# EAGLE design 5watch (EAGLE 7.4.0)
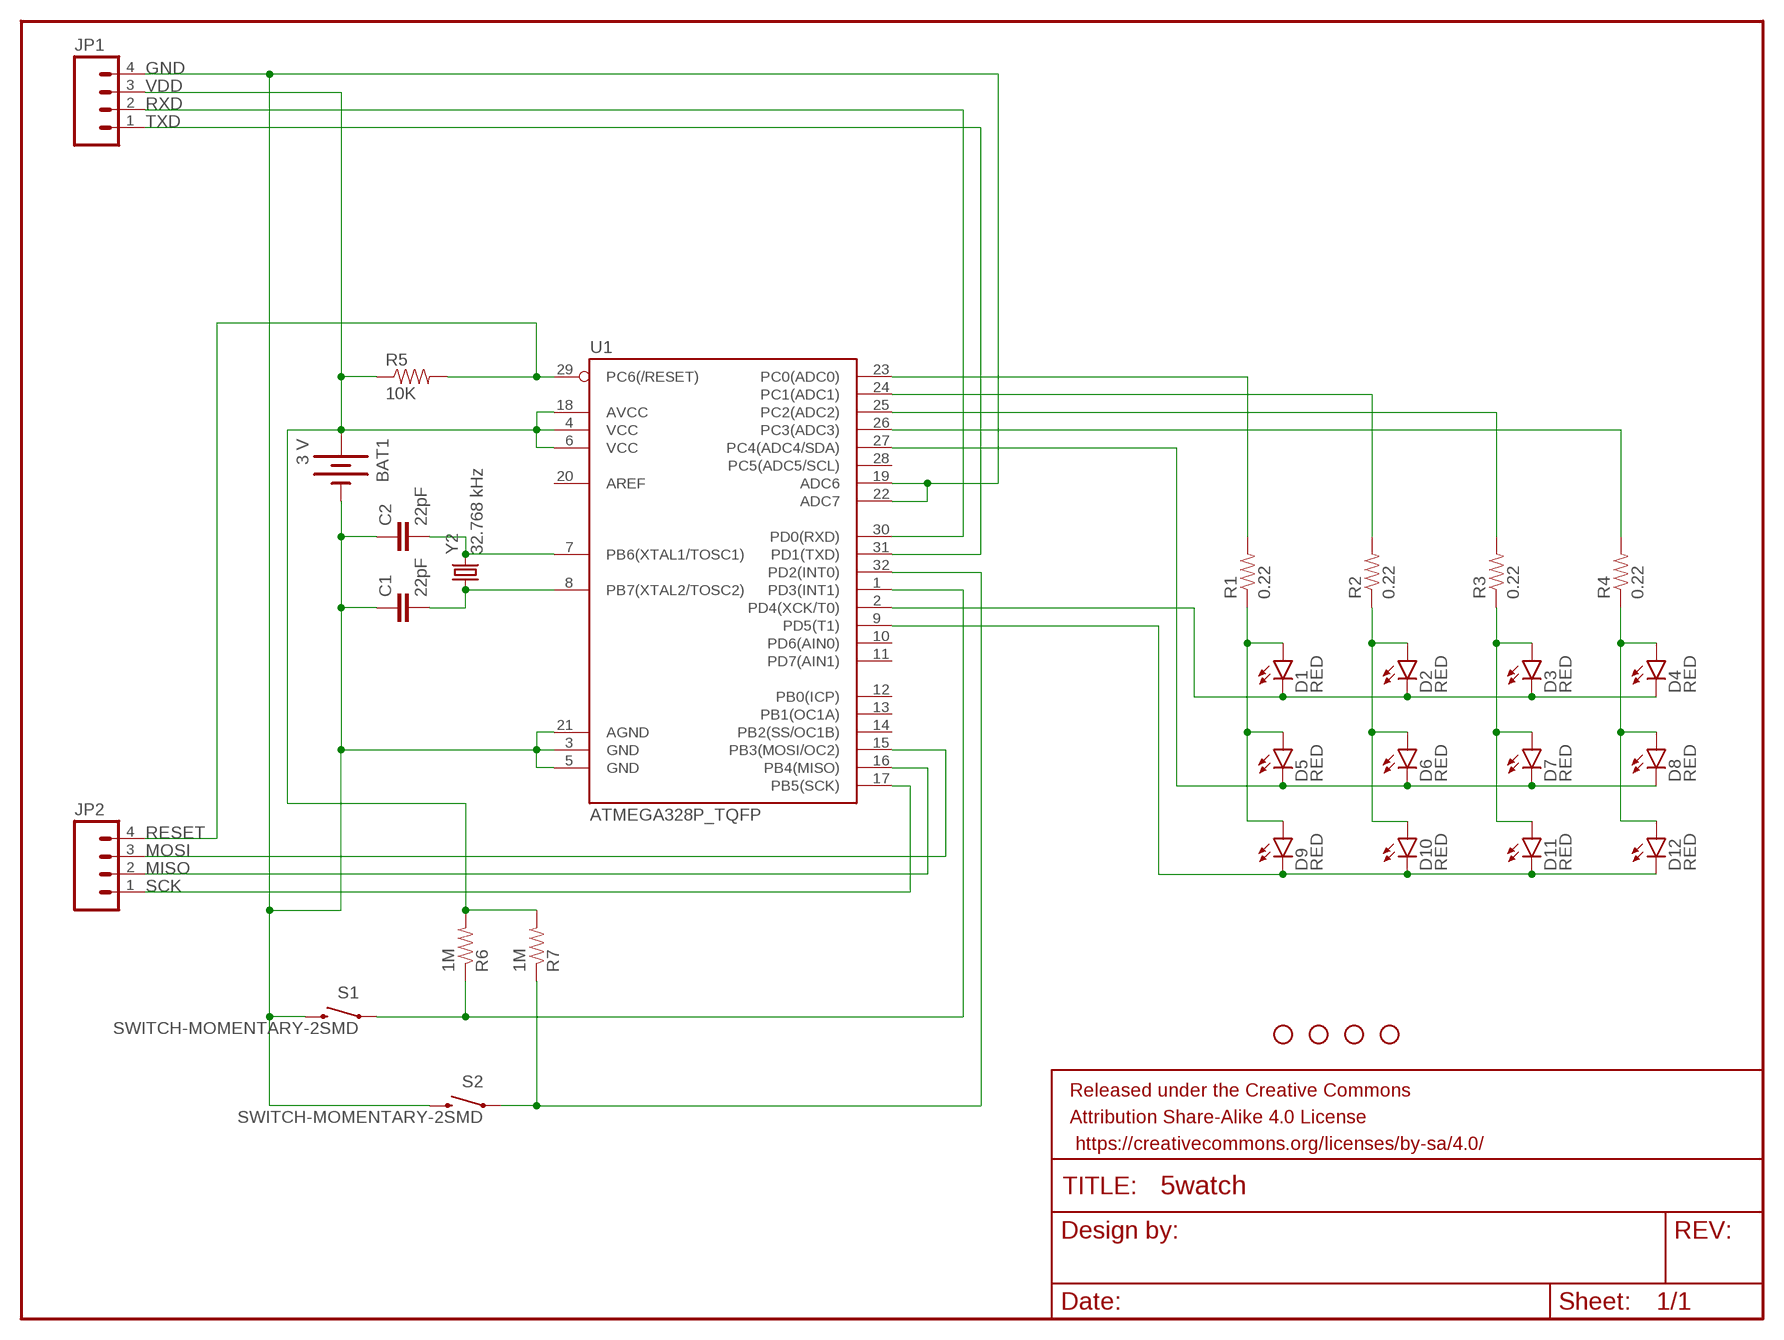
[diagram p0: schematic, sheet 1]

## Parts
BAT1  3 V  BATTERY20MM_4LEGS  [BATTCON_20MM_4LEGS]
C1  22pF  22PF-50V-5%(0603)  [0603-CAP]
C2  22pF  22PF-50V-5%(0603)  [0603-CAP]
D1  RED  LED-RED1206  [LED-1206]
D2  RED  LED-RED1206  [LED-1206]
D3  RED  LED-RED1206  [LED-1206]
D4  RED  LED-RED1206  [LED-1206]
D5  RED  LED-RED1206  [LED-1206]
D6  RED  LED-RED1206  [LED-1206]
D7  RED  LED-RED1206  [LED-1206]
D8  RED  LED-RED1206  [LED-1206]
D9  RED  LED-RED1206  [LED-1206]
D10  RED  LED-RED1206  [LED-1206]
D11  RED  LED-RED1206  [LED-1206]
D12  RED  LED-RED1206  [LED-1206]
FRAME1  FRAME-LETTER  [CREATIVE_COMMONS]
JP1  M04NO_SILK_ALL_ROUND  [1X04_NO_SILK_ALL_ROUND]
JP2  M04NO_SILK_ALL_ROUND  [1X04_NO_SILK_ALL_ROUND]
R1  0.22  0.22OHM-1/4W-1%(0805)  [0805]
R2  0.22  0.22OHM-1/4W-1%(0805)  [0805]
R3  0.22  0.22OHM-1/4W-1%(0805)  [0805]
R4  0.22  0.22OHM-1/4W-1%(0805)  [0805]
R5  10K  10KOHM-1/10W-1%(0603)0603  [0603-RES]
R6  1M  1MOHM-1/10W-1%(0603)  [0603-RES]
R7  1M  1MOHM-1/10W-1%(0603)  [0603-RES]
S1  SWITCH-MOMENTARY-2SMD  [TACTILE-SWITCH-SMD]
S2  SWITCH-MOMENTARY-2SMD  [TACTILE-SWITCH-SMD]
STANDOFF1  STAND-OFF  [STAND-OFF]
STANDOFF2  STAND-OFF  [STAND-OFF]
STANDOFF3  STAND-OFF  [STAND-OFF]
STANDOFF4  STAND-OFF  [STAND-OFF]
U1  ATMEGA328P_TQFP  [TQFP32-08]
Y2  32.768 kHz  CRYSTAL32-SMD  [CRYSTAL-32KHZ-SMD]

## Nets
GND: BAT1.2(-) C1.1 C2.1 JP1.4 S1.3 S2.3 U1.3(GND) U1.5(GND) U1.19(ADC6) U1.21(AGND) U1.22(ADC7)
MISO: JP2.2 U1.16(PB4(MISO))
MOSI: JP2.3 U1.15(PB3(MOSI/OC2))
N$1: D2.A D6.A D10.A R2.1
N$2: D3.A D7.A D11.A R3.1
N$3: D4.A D8.A D12.A R4.1
N$4: D1.A D5.A D9.A R1.1
N$5: D1.C D2.C D3.C D4.C U1.2(PD4(XCK/T0))
N$6: D5.C D6.C D7.C D8.C U1.27(PC4(ADC4/SDA))
N$7: D9.C D10.C D11.C D12.C U1.9(PD5(T1))
N$8: C2.2 U1.7(PB6(XTAL1/TOSC1)) Y2.X2
N$9: R6.1 S1.1 U1.1(PD3(INT1))
N$10: C1.2 U1.8(PB7(XTAL2/TOSC2)) Y2.X1
N$13: R4.2 U1.26(PC3(ADC3))
N$19: R3.2 U1.25(PC2(ADC2))
N$20: R2.2 U1.24(PC1(ADC1))
N$21: R1.2 U1.23(PC0(ADC0))
N$23: R7.1 S2.1 U1.32(PD2(INT0))
RESET: JP2.4 R5.2 U1.29(PC6(/RESET))
RXD: JP1.2 U1.30(PD0(RXD))
SCK: JP2.1 U1.17(PB5(SCK))
TXD: JP1.1 U1.31(PD1(TXD))
VDD: BAT1.1(+) JP1.3 R5.1 R6.2 R7.2 U1.4(VCC) U1.6(VCC) U1.18(AVCC)
Unconnected: U1.10(PD6(AIN0)) U1.11(PD7(AIN1)) U1.12(PB0(ICP)) U1.13(PB1(OC1A)) U1.14(PB2(SS/OC1B)) U1.20(AREF) U1.28(PC5(ADC5/SCL))

## Library data of the parts
BAT1 = SparkFun-Electromechanical:BATTERY: Battery Holders Various common sizes : AA, AAA, 18650 (PRT-12895), 20mm coin cell and 12mm coin cell. 20MM_4LEGS, BATT-10373; PROD_ID: BATT-10373; VALUE: 20mm coincell
C1 C2 = SparkFun-Capacitors:22PF-50V-5%(0603): CAP-07876; PROD_ID: CAP-07876
D1-D12 = SparkFun-LED:LED-RED: Assorted Red LEDs LilyPad 1206- DIO-09912 1206- DIO-00809 0603- DIO-00819 "SMART" means more efficient and expensive; PROD_ID: DIO-09912
FRAME1 = SparkFun-Aesthetics:FRAME-LETTER: Schematic Frame Standard 8.5x11 US Letter frame
JP1 JP2 = SparkFun-Connectors:M04: Header 4 Standard 4-pin 0.1" header. Use with straight break away headers (SKU : PRT-00116), right angle break away headers (PRT-00553), swiss pins (PRT-00743), machine pins (PRT-00117), and female headers (PRT-00115). Molex polarized connector foot print use with SKU : PRT-08231 with associated crimp pins and housings. 1MM SMD Version SKU: PRT-10208
R1-R4 = SparkFun-Resistors:0.22OHM-1/4W-1%(0805): RES-09883; PROD_ID: RES-09883
R5 = SparkFun-Resistors:10KOHM-1/10W-1%(0603): RES-00824; PROD_ID: RES-00824
R6 R7 = SparkFun-Resistors:1MOHM-1/10W-1%(0603): RES-07868; PROD_ID: RES-07868
S1 S2 = SparkFun-Electromechanical:SWITCH-MOMENTARY-2: Various NO switches- pushbuttons, reed, etc; PROD_ID: SWCH-08247
STANDOFF1-STANDOFF4 = SparkFun-Electromechanical:STAND-OFF: #4 Stand Off This is the mechanical footprint for a #4 phillips button head screw. Use the keepout ring to avoid running the screw head into surrounding components. SKU : PRT-00447
U1 = SparkFun-DigitalIC:ATMEGA328P_TQFP; PROD_ID: IC-09069
Y2 = SparkFun-FreqCtrl:CRYSTAL: Various standard crystals. Proven footprints.; PROD_ID: XTAL-07894

## Net classes
0 default: width 0.152 mm, drill 0.33 mm, clearance 0.152 mm
1 larger: width 0.254 mm, drill 0.254 mm, clearance 0.254 mm

## Board
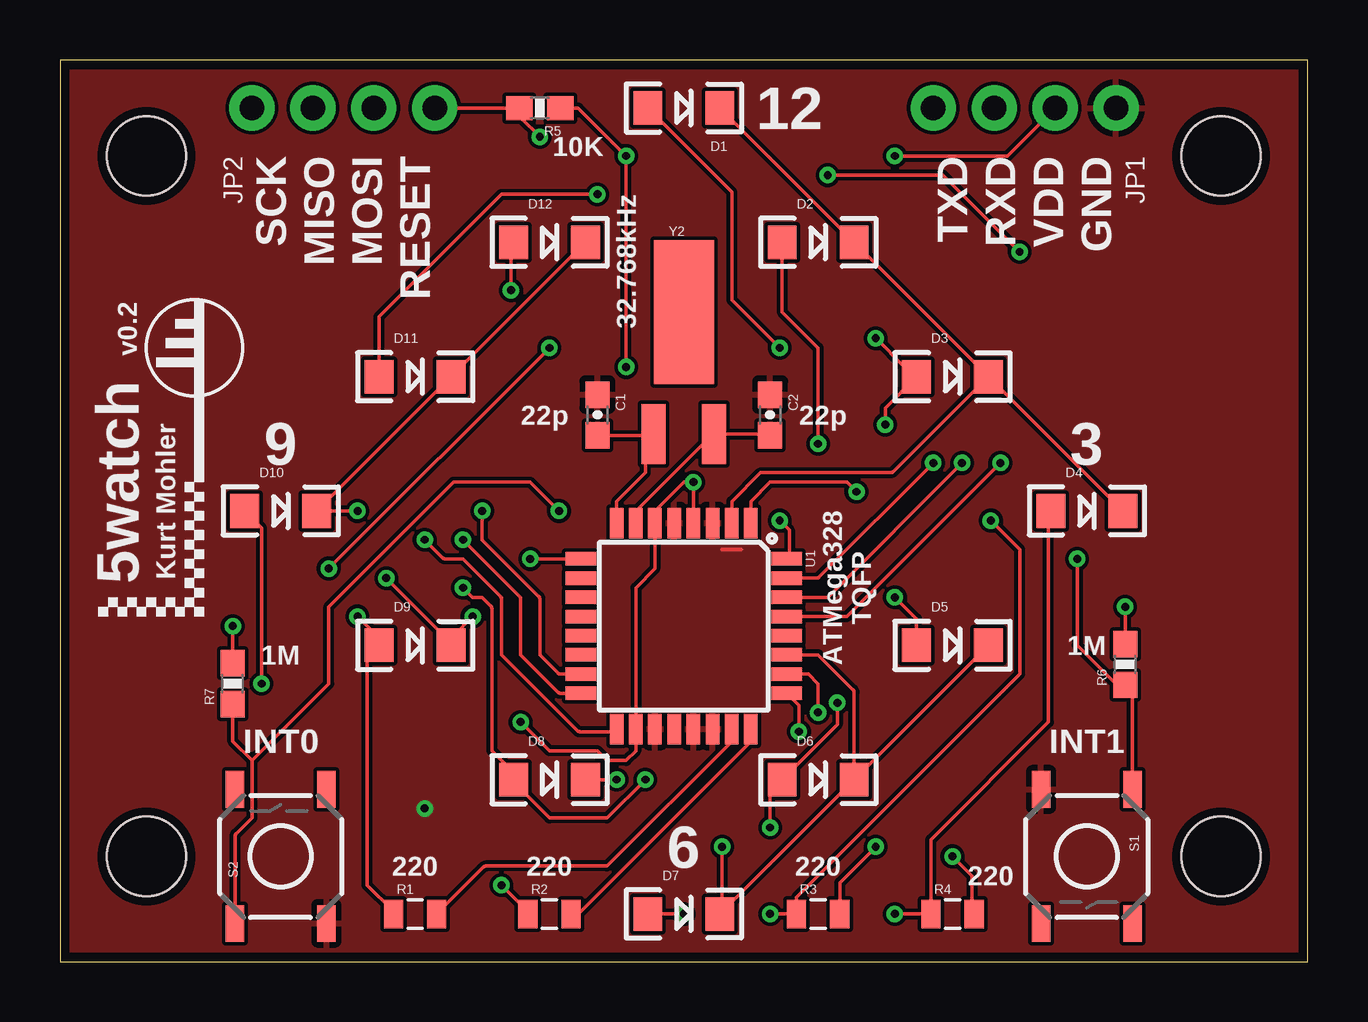
[diagram p1: board, top side]
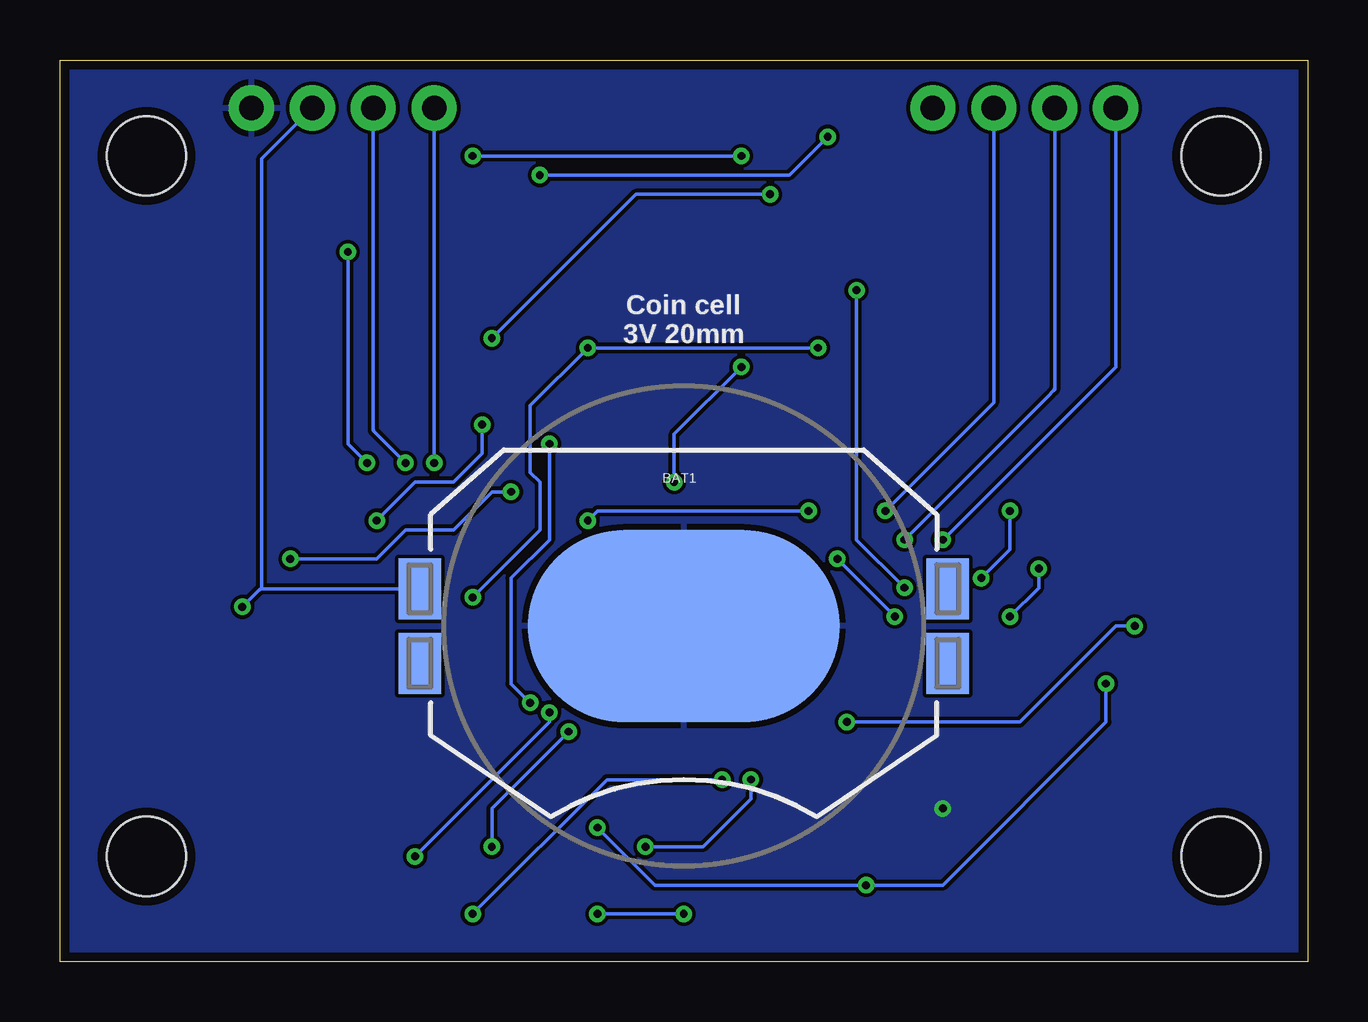
[diagram p2: board, bottom side, seen from below]

Size 52 x 37.6 mm. Coordinates in mm from the lower left corner, seen from the top.
Outline: 0,0 52,0 52,37.6 0,37.6 0,0
Copper layers (1*16): Top 0.0356mm / dielectric 1.5011mm / Bottom 0.0356mm
Design rules "LaenPCBOrder": minimum track width 6mil, minimum drill 13mil, track to track 6mil, track to pad 6mil, pad to pad 6mil, via to via 6mil, smd to smd 6mil, copper to edge 15mil, drill to drill 6mil, minimum pad ring 7mil, minimum via ring 7mil, stop-mask expansion 3mil, vias tented up to drill 0mil, thermal gap 10mil

### Footprints (pad centres in the part's own frame; a part is rotated, then mirrored left to right if it is on the bottom)
BATTCON_20MM_4LEGS = smd 1.778 x 2.54: 1 -11,1.55; 3 11,1.55; P$1 -11,-1.55; P$2 11,-1.55 | smd 13 x 8: 2 0,0
0603-CAP = smd 1.1 x 1: 1 -0.85,0; 2 0.85,0
LED-1206 = smd 1.2 x 1.4: A -1.5,0; C 1.5,0
1X04_NO_SILK_ALL_ROUND = drill 1.016 pad 1.88: 1 0,0; 2 2.54,0; 3 5.08,0; 4 7.62,0
0805 = smd 0.8 x 1.2: 1 -0.9,0; 2 0.9,0
0603-RES = smd 1.1 x 1: 1 -0.85,0; 2 0.85,0
TACTILE-SWITCH-SMD = smd 1.524 x 0.762: 1 -2.794,1.905; 2 2.794,1.905; 3 -2.794,-1.905; 4 2.794,-1.905
STAND-OFF = hole 3.302: 0,0
TQFP32-08 = smd 1.27 x 0.559: 1 -4.293,2.8; 2 -4.293,2; 3 -4.293,1.2; 4 -4.293,0.4; 5 -4.293,-0.4; 6 -4.293,-1.2; 7 -4.293,-2; 8 -4.293,-2.8; 17 4.293,-2.8; 18 4.293,-2; 19 4.293,-1.2; 20 4.293,-0.4; 21 4.293,0.4; 22 4.293,1.2; 23 4.293,2; 24 4.293,2.8 | smd 0.559 x 1.27: 9 -2.8,-4.293; 10 -2,-4.293; 11 -1.2,-4.293; 12 -0.4,-4.293; 13 0.4,-4.293; 14 1.2,-4.293; 15 2,-4.293; 16 2.8,-4.293; 25 2.8,4.293; 26 2,4.293; 27 1.2,4.293; 28 0.4,4.293; 29 -0.4,4.293; 30 -1.2,4.293; 31 -2,4.293; 32 -2.8,4.293
CRYSTAL-32KHZ-SMD = smd 2.5 x 6: SHEILD 0,5.08 | smd 1 x 2.5: X1 -1.27,0; X2 1.27,0

### Placement (x,y rotation side)
BAT1  26,14 0 bottom
C1  22.4,22.8 270 top
C2  29.6,22.8 270 top
D1  26,35.6 0 top
D2  31.6,30 0 top
D3  37.2,24.4 0 top
D4  42.8,18.8 0 top
D5  37.2,13.2 0 top
D6  31.6,7.6 0 top
D7  26,2 0 top
D8  20.4,7.6 0 top
D9  14.8,13.2 0 top
D10  9.2,18.8 0 top
D11  14.8,24.4 0 top
D12  20.4,30 0 top
FRAME1  -7.2,-12.01 0 top  (outside the outline)
JP1  36.4,35.6 0 top
JP2  8,35.6 0 top
R1  14.8,2 0 top
R2  20.4,2 0 top
R3  31.6,2 0 top
R4  37.2,2 0 top
R5  20,35.6 180 top
R6  44.4,12.4 90 top
R7  7.2,11.6 90 top
S1  42.8,4.4 270 top
S2  9.2,4.4 90 top
STANDOFF1  48.4,4.4 0 top
STANDOFF2  48.4,33.6 0 top
STANDOFF3  3.6,4.4 0 top
STANDOFF4  3.6,33.6 0 top
U1  26,14 270 top
Y2  26,22 0 top

### Tracks (layer width: path | path; a pad name or v marks a point on that pad's centre or on a via)
GND  (via drill 0.33)
  Top 0.152: 28.4,17.2 27.6,17.2
  other vias: 15.2,6.4
  pour Bottom: 0,37.6 52,37.6 52,0 0,0
  pour Top: 0,37.6 52,37.6 52,0 0,0
MISO  (via drill 0.33)
  Top 0.152: U1.16 20.86,11.2 arc-45 20.75,11.24 19.2,12.8 19.2,15.14 arc45 19.16,15.24 v16.8,17.6
  Bottom 0.152: JP2.2 10.54,23.92 | 10.54,23.92 arc45 10.59,23.82 | 10.59,23.82 10.8,23.6 v16.8,17.6 | 10.54,23.92 10.54,23.86 10.59,23.82
MOSI  (via drill 0.33)
  Top 0.152: U1.15 20.86,12 arc-45 20.75,12.04 20,12.8 20,15.14 arc45 19.95,15.24 17.6,17.6 v17.6,18.8
  Bottom 0.152: JP2.3 13.08,23.32 v17.6,18.8
N$1  (via drill 0.33)
  Top 0.152: 8,18.44 arc45 7.96,18.55 D10.A 8.4,18.1 v8.4,11.6 | D6.A 30.1,7.36 arc-45 30.05,7.25 | v18.4,3.2 19.2,2.4 19.2,2.36 arc45 19.25,2.25 R2.1 | D2.A 30.1,27.1 31.6,25.6 v31.6,21.6 | v32.4,10.8 32.4,9.9 D6.A | v29.6,5.6 29.6,7.1 D6.A
  Bottom 0.152: v8.4,11.6 8.4,10 15.2,3.2 v18.4,3.2 27.2,3.2 v29.6,5.6 | v31.6,21.6 31.6,17.6 33.2,16 33.2,11.6 v32.4,10.8
N$2  (via drill 0.33)
  Top 0.152: D7.A v26,2 | v29.6,2 R3.1 30.7,2.7 40,12 40,17.2 v38.8,18.4 | D11.A 13.3,26.9 18.4,32 v22.4,32 | v34,26 35.2,24.8 35.3,24.8 D3.A 34.4,23.1 v34.4,22.4
  Bottom 0.152: v26,2 v29.6,2 | v22.4,32 28,32 v34,26 | v38.8,18.4 37.2,20 35.6,20 34.4,21.2 v34.4,22.4
N$3  (via drill 0.33)
  Top 0.152: v18.8,28 18.8,29.84 arc-45 18.84,29.95 D12.A | v16.8,15.6 17.2,15.2 17.6,15.2 17.95,14.85 arc-45 18,14.74 18,8.8 18.86,7.95 arc-45 18.9,7.84 D8.A 18.9,7.56 arc45 18.95,7.46 20.4,6 22.8,6 v24.4,7.6 | v34.8,2 R4.1 36.3,5.1 41.2,10 41.2,18.7 D4.A
  Bottom 0.152: v16.8,15.6 16.8,15.54 arc-45 16.84,15.64 18.8,17.6 v18.8,28 | v34.8,2 29.2,7.6 v24.4,7.6
N$4  (via drill 0.33)
  Top 0.152: R1.1 13.9,2.04 arc45 13.86,2.15 12.8,3.2 12.8,12.64 arc-45 12.85,12.74 D9.A 13.3,13.5 v12.4,14.4 | D5.A 35.7,14.3 v34.8,15.2 | v30,25.6 28,27.6 28,32.1 D1.A | v11.2,16.4 v20.4,25.6
  Bottom 0.152: v34.8,15.2 32,18 32,20 32.4,20.4 32.4,23.2 v30,25.6 v20.4,25.6 | v12.4,14.4 11.2,15.6 v11.2,16.4
N$5
  Top 0.152: D1.C D2.C D3.C | D3.C D4.C | U1.2 28,19.2 29.2,20.4 34.64,20.4 arc45 34.74,20.45 D3.C
N$6  (via drill 0.33)
  Top 0.152: D5.C D6.C | D6.C D7.C | D6.C 33.1,11.24 arc45 33.05,11.35 31.6,12.8 U1.27 | D7.C 27.26,2 arc-45 27.16,2.04 | D8.C v23.2,7.6 | v27.6,4.8 27.6,2.1 D7.C
  Bottom 0.152: v23.2,7.6 23.2,6.8 25.2,4.8 v27.6,4.8
N$7  (via drill 0.33)
  Top 0.152: D12.C D11.C D10.C v12.4,18.8 | U1.9 v19.6,16.8 | v17.2,14.4 16.4,13.6 | 16.4,13.6 16.4,13.36 arc-45 16.36,13.26 D9.C | 16.4,13.6 16,13.6 v13.6,16
  Bottom 0.152: v19.6,16.8 v17.2,14.4 | v12.4,18.8 12.4,17.2 v13.6,16
N$8
  Top 0.152: C2.2 C2.2 arc45 29.49,22 Y2.X2 26.87,21.6 26.8,21.6 24,18.8 U1.7
N$9  (via drill 0.33)
  Top 0.152: S1.1 44.7,11.18 arc45 44.66,11.29 R6.1 44.35,11.6 44,11.6 42.4,13.2 v42.4,16.8 | 28.8,18.4 U1.1 28.8,19.2 29.6,20 32.8,20 v33.2,19.6
  Bottom 0.152: v42.4,16.8 38.8,16.8 37.6,18 35.6,18 34,19.6 v33.2,19.6
N$10
  Top 0.152: C1.2 24.62,21.95 arc45 Y2.X1 24.45,21.71 arc45 24.4,21.61 24.4,20.4 23.2,19.2 U1.8
N$13  (via drill 0.33)
  Top 0.152: U1.26 31.2,12 31.6,11.6 v31.6,10.4 | v37.2,4.4 38,3.6 38,2.1 R4.2
  Bottom 0.152: v31.6,10.4 31.6,10 v37.2,4.4
N$19  (via drill 0.33)
  Top 0.152: R3.2 32.5,3.3 v34,4.8 | v30.8,9.6 30.8,10.69 U1.25
  Bottom 0.152: v34,4.8 34,6.4 v30.8,9.6
N$20
  Top 0.152: R2.2 21.54,2 arc45 21.64,2.04 21.58,2.04 arc45 21.69,2.09 28.8,9.2 U1.24
N$21
  Top 0.152: U1.23 28,9.2 22.8,4 17.76,4 arc45 17.66,3.96 R1.2
N$23  (via drill 0.33)
  Top 0.152: S2.1 7.29,5.23 arc-45 7.34,5.34 8,6 8,8.4 | 8,8.4 7.2,9.2 R7.1 | 8,8.4 11.2,11.6 11.2,14.8 16.4,20 19.6,20 v20.8,18.8 | v30,18.4 30.4,18 30.4,16.91 U1.32
  Bottom 0.152: v20.8,18.8 29.6,18.8 v30,18.4
RESET  (via drill 0.33)
  Top 0.152: JP2.4 R5.2 19.2,35.55 19.2,35.2 v20,34.4 | U1.29 32.8,14.4 v39.2,20.8 | v40,29.6 36.8,32.8 v32,32.8
  Bottom 0.152: v32,32.8 21.6,32.8 v20,34.4 | v39.2,20.8 40,21.6 v40,29.6
RXD  (via drill 0.33)
  Top 0.152: v37.6,20.8 32,15.2 U1.30
  Bottom 0.152: JP1.2 38.94,22.2 arc-45 38.9,22.09 v37.6,20.8
SCK  (via drill 0.33)
  Top 0.152: U1.17 23.2,9.6 21.66,9.6 arc-45 21.55,9.64 18.4,12.8 18.4,15.2 18.36,15.24 | 18.4,15.14 arc45 18.36,15.24 | 18.36,15.24 16.8,16.8 16.06,16.8 arc-45 15.96,16.84 v15.2,17.6
  Bottom 0.152: v15.2,17.6 8,24.8 JP2.1
TXD  (via drill 0.33)
  Top 0.152: U1.31 31.54,16 arc45 31.64,16.05 v36.4,20.8
  Bottom 0.152: v36.4,20.8 JP1.1
VDD  (via drill 0.33)
  Top 0.152: v44.4,14.8 R6.2 | v19.2,10 20.4,8.8 22.4,8.8 22.8,8.4 23.6,8.4 24,8.8 U1.18 24,15.6 24.8,16.4 U1.6 24.8,18.8 26,20 v26.4,20 U1.4 | v7.2,14 R7.2 | v23.6,24.8 v23.6,33.6 21.6,35.6 R5.1 | v34.8,33.6 39.48,33.6 JP1.3
  Bottom 0.152: BAT1.1 43.59,15.55 | 43.59,15.55 arc-45 43.7,15.51 v44.4,14.8 | v19.2,10 12,10 8,14 v7.2,14 | v26.4,20 26.4,22 v23.6,24.8 | 43.59,15.55 43.59,33.49 JP1.3 | v23.6,33.6 v34.8,33.6

### Text on the board
tPlace: 12 | SCK | MISO | MOSI | RESET | 10K | TXD | RXD | VDD | GND | v0.2 | 32.768kHz | 22p | 22p | 9 | 3 | 5watch | Kurt Mohler | ATMega328 / TQFP | 1M | 1M | INT0 | INT1 | 6 | 220 | 220 | 220 | 220
bPlace: Coin cell / 3V 20mm